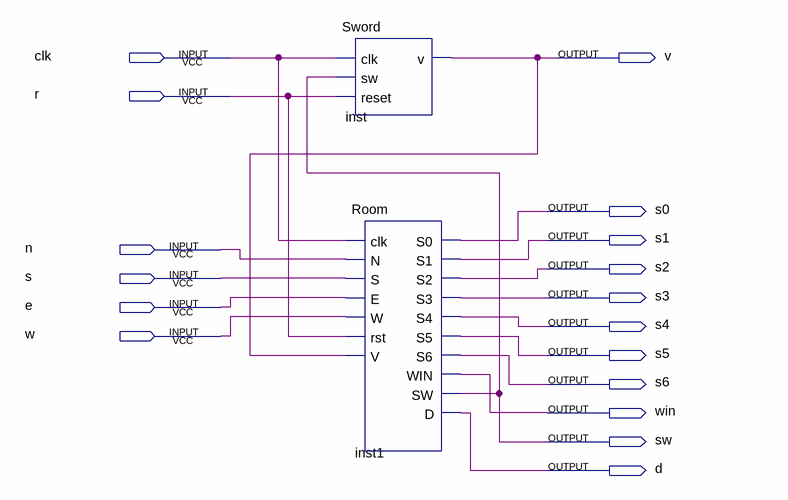
[diagram p0: schematic sheet]
// Quartus schematic Game.bdf as structural Verilog: 2 symbols, 17 pins
module Game (
  input  clk,
  input  r,
  input  n,
  input  s,
  input  e,
  input  w,
  output v,
  output s0,
  output s1,
  output s2,
  output s3,
  output s4,
  output s5,
  output s6,
  output win,
  output sw,
  output d
);

  Sword inst (.clk(clk), .sw(sw), .reset(r), .v(v));
  Room inst1 (
    .clk(clk), .N(n), .S(s), .E(e), .W(w), .rst(r), .V(v), .S0(s0), .S1(s1), .S2(s2), .S3(s3), .S4(s4),
    .S5(s5), .S6(s6), .WIN(win), .SW(sw), .D(d));
endmodule
